# Altium schematic sheet RFID_PLAYER.SchDoc
size A3
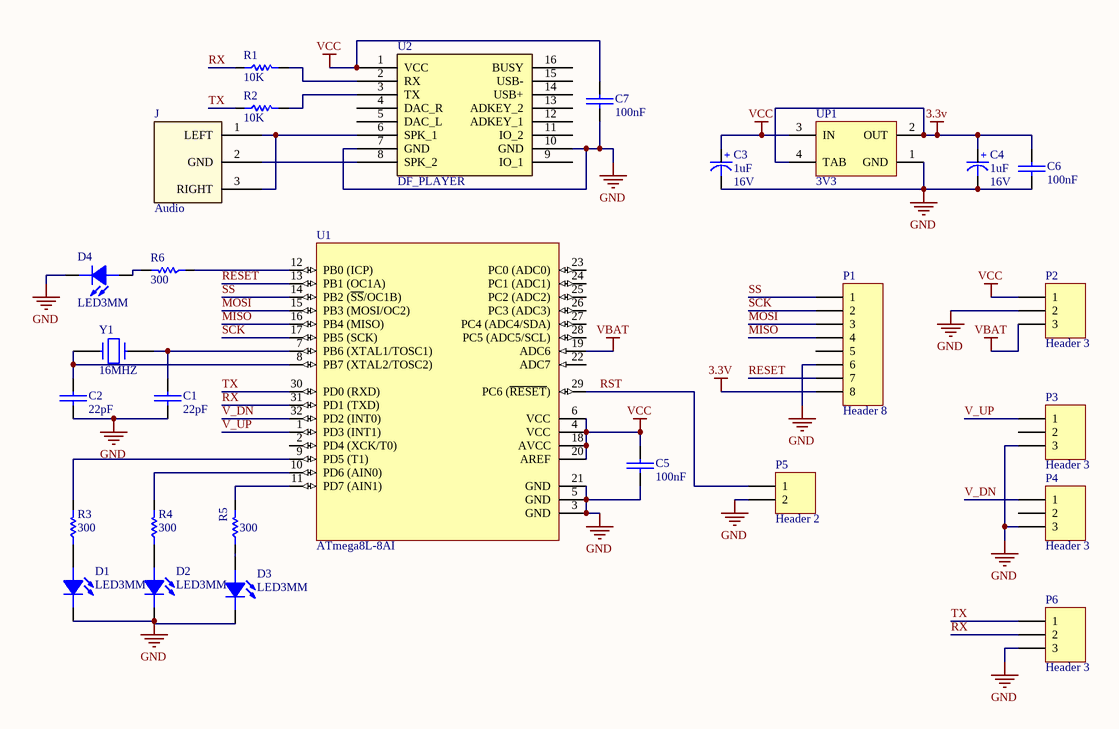
[diagram p0: RFID_PLAYER.SchDoc]

## Parts
C1  22pF  [SMD_CAP_1206]
C2  22pF  [SMD_CAP_1206]
C3  Voltage: 16V  [cap 01]  (hidden comment: 1uF)
C4  Voltage: 16V  [cap 01]  (hidden comment: 1uF)
C5  100nF  [SMD_CAP_1206]
C6  100nF  [SMD_CAP_1206]
C7  100nF  [SMD_CAP_1206]
D1  LED3MM  [LED3mm_GRN]
D2  LED3MM  [LED3mm_GRN]
D3  LED3MM  [LED3mm_GRN]
D4  LED3MM  [LED3mm_GRN]
J  Audio  [PCBComponent_1]
P1  Header 8  [HDR1X8]
P2  Header 3  [HDR1X3]
P3  Header 3  [HDR1X3]
P4  Header 3  [HDR1X3]
P5  Header 2  [HDR1X2]
P6  Header 3  [HDR1X3]
R1  10K  [RES 1206 (3216X08L)]
R2  10K  [RES 1206 (3216X08L)]
R3  300  [RES 1206 (3216X08L)]
R4  300  [RES 1206 (3216X08L)]
R5  300  [RES 1206 (3216X08L)]
R6  300  [RES 1206 (3216X08L)]
U1  ATmega8L-8AI  [32A_N]
U2  DF_PLAYER  [PCBComponent_1]
UP1  3V3  [SOT223]
Y1  16MHZ  [My_Crystal]

## Nets
3.3V: C4.1(+) C6.1(+) P1.8 UP1.2(OUT) UP1.4(TAB)
GND: C1.2(-) C2.2(-) C3.2(-) C4.2(-) C5.2(-) C6.2(-) C7.2(-) D1.2(CATHODE) D2.2(CATHODE) D3.2(CATHODE) D4.2(CATHODE) P1.6 P2.2 P3.3 P4.3 P5.2 P6.3 U1.3(GND) U1.5(GND) U1.21(GND) U2.7(GND) U2.10(GND) UP1.1(GND)
VBAT: P2.3 U1.19(ADC6)
VCC: C3.1(+) C5.1(+) C7.1(+) P2.1 U1.4(VCC) U1.6(VCC) U1.18(AVCC) U1.20(AREF) U2.1(VCC) UP1.3(IN)
MISO: P1.4 U1.16(PB4_(MISO))
MOSI: P1.3 U1.15(PB3_(MOSI/OC2))
RESET: P1.7 U1.13(PB1_(OC1A))
RST: P5.1 U1.29(PC6_(~{RESET}))
RX: P6.2 R1.1 U1.31(PD1_(TXD))
SCK: P1.2 U1.17(PB5_(SCK))
SS: P1.1 U1.14(PB2_(~{SS}/OC1B))
TX: P6.1 R2.1 U1.30(PD0_(RXD))
V_DN: P4.1 U1.32(PD2_(INT0))
V_UP: P3.1 U1.1(PD3_(INT1))
NetC1_1: C1.1(+) U1.7(PB6_(XTAL1/TOSC1)) Y1.1
NetC2_1: C2.1(+) U1.8(PB7_(XTAL2/TOSC2)) Y1.2
NetD1_1: D1.1(ANODE) R3.1
NetD2_1: D2.1(ANODE) R4.1
NetD3_1: D3.1(ANODE) R5.1
NetD4_1: D4.1(ANODE) R6.2
NetJ_1: J.1(LEFT) J.3(RIGHT) U2.6(SPK_1)
NetJ_2: J.2(GND) U2.8(SPK_2)
NetR1_2: R1.2 U2.2(RX)
NetR2_2: R2.2 U2.3(TX)
NetR3_2: R3.2 U1.9(PD5_(T1))
NetR4_2: R4.2 U1.10(PD6_(AIN0))
NetR5_2: R5.2 U1.11(PD7_(AIN1))
NetR6_1: R6.1 U1.12(PB0_(ICP))

Not connected (* = marked no-connect by the designer): P1 5; P3 2; P4 2; U1 2(PD4_(XCK/T0)) 22(ADC7) 23(PC0_(ADC0)) 24(PC1_(ADC1)) 25(PC2_(ADC2)) 26(PC3_(ADC3)) 27(PC4_(ADC4/SDA)) 28(PC5_(ADC5/SCL)); U2 4(DAC_R) 5(DAC_L) 9(IO_1) 11(IO_2) 12(ADKEY_1) 13(ADKEY_2) 14(USB+) 15(USB-) 16(BUSY)

## Library data of the parts
C1 C2 C5-C7 = Cap-Bipolar: Bipolar Capacitor; Voltage: 100V; Designer: Saeid Jorablo; Organazation: ControTec; Adding Date: 1387/12/20
  C1 C2: Value: 22pF
  C5-C7: Value: 100nF
C3 C4 = Cap-Polar: Polar Capacitor; Designer: Saeid Jorablo; Organazation: ControTec; Adding Date: 1387/12/20; Value: 1uF
D1-D4 = LED 3MM: Light Emitting Diode; Designer: Ali Hafizi
J = 3.5mm_Audio
P1 = Header 8: Header, 8-Pin; LatestRevisionDate: 17-Jul-2002; LatestRevisionNote: Re-released for DXP Platform.; Publisher: Altium Limited
P2-P4 P6 = Header 3: Header, 3-Pin; LatestRevisionDate: 17-Jul-2002; LatestRevisionNote: Re-released for DXP Platform.; Publisher: Altium Limited
P5 = Header 2: Header, 2-Pin; LatestRevisionDate: 17-Jul-2002; LatestRevisionNote: Re-released for DXP Platform.; Publisher: Altium Limited
R1-R6 = Resistor
  R1 R2: Value: 10K
  R3-R6: Value: 300
U1 = ATmega8L-8AI: 8-Bit AVR Microcontroller with 8K Bytes of In-System Programmable Flash Memory; Published: 2017-1-4; LatestRevisionDate: 16-Oct-2006; LatestRevisionNote: IPC-7351 Footprint Added.; DatasheetVersion: 2486H-AVR-09/02; PackageVersion: 2017-1-4; PackageReference: 32A; Publisher: Abbas Basereh; PackageDescription: 32-Lead, 7x7x1.0 mm Body, 0.8mm Lead Pitch, Thin Profile Plastic Quad Flat Package (TQFP); Supplier 1: Digi-Key; Supplier Part Number 1: ATMEGA8L-8AI-ND; Supplier 2: Farnell; Supplier Part Number 2: 3917952; Supplier 3: Mouser; Supplier Part Number 3: 556-ATMEGA8L-8AI; Code_JEDEC: MS-026-ABA; ComponentLink1Description: Datasheet; ComponentLink1URL: http://www.atmel.com/dyn/resources/prod_documents/doc2486.pdf; ComponentLink2Description: Atmel.com Home; ComponentLink2URL: http://www.atmel.com
UP1 = AMS1117-x.x: x.x Volt, 800mA Low-Dropout Linear Regulator, 4-pin SOT-223; Designer: Ali Hafizi; Data: 16-12-2016
Y1 = CRYSTAL